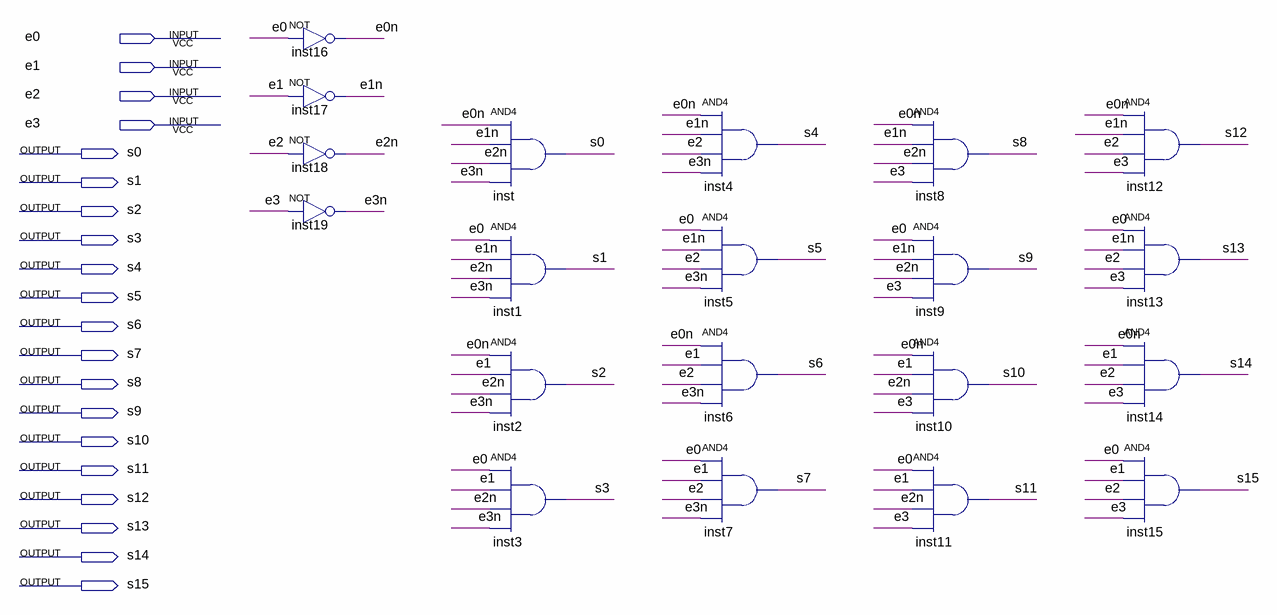
[diagram p0: schematic sheet]
// Quartus schematic bfs_decod_4x16.bdf as structural Verilog: 20 symbols, 20 pins
module bfs_decod_4x16 (
  input  e0,
  input  e1,
  input  e2,
  input  e3,
  output s0,
  output s1,
  output s2,
  output s3,
  output s4,
  output s5,
  output s6,
  output s7,
  output s8,
  output s9,
  output s10,
  output s11,
  output s12,
  output s13,
  output s14,
  output s15
);

  wire e0n, e1n, e2n, e3n;

  not inst16 (e0n, e0);
  not inst17 (e1n, e1);
  not inst18 (e2n, e2);
  not inst19 (e3n, e3);
  and inst (s0, e0n, e1n, e2n, e3n);
  and inst1 (s1, e0, e1n, e2n, e3n);
  and inst2 (s2, e0n, e1, e2n, e3n);
  and inst3 (s3, e0, e1, e2n, e3n);
  and inst4 (s4, e0n, e1n, e2, e3n);
  and inst5 (s5, e0, e1n, e2, e3n);
  and inst6 (s6, e0n, e1, e2, e3n);
  and inst7 (s7, e0, e1, e2, e3n);
  and inst8 (s8, e0n, e1n, e2n, e3);
  and inst9 (s9, e0, e1n, e2n, e3);
  and inst10 (s10, e0n, e1, e2n, e3);
  and inst11 (s11, e0, e1, e2n, e3);
  and inst12 (s12, e0n, e1n, e2, e3);
  and inst13 (s13, e0, e1n, e2, e3);
  and inst14 (s14, e0n, e1, e2, e3);
  and inst15 (s15, e0, e1, e2, e3);
endmodule
